# Altium schematic sheet Battery PCB 8x4.SchDoc
size A4
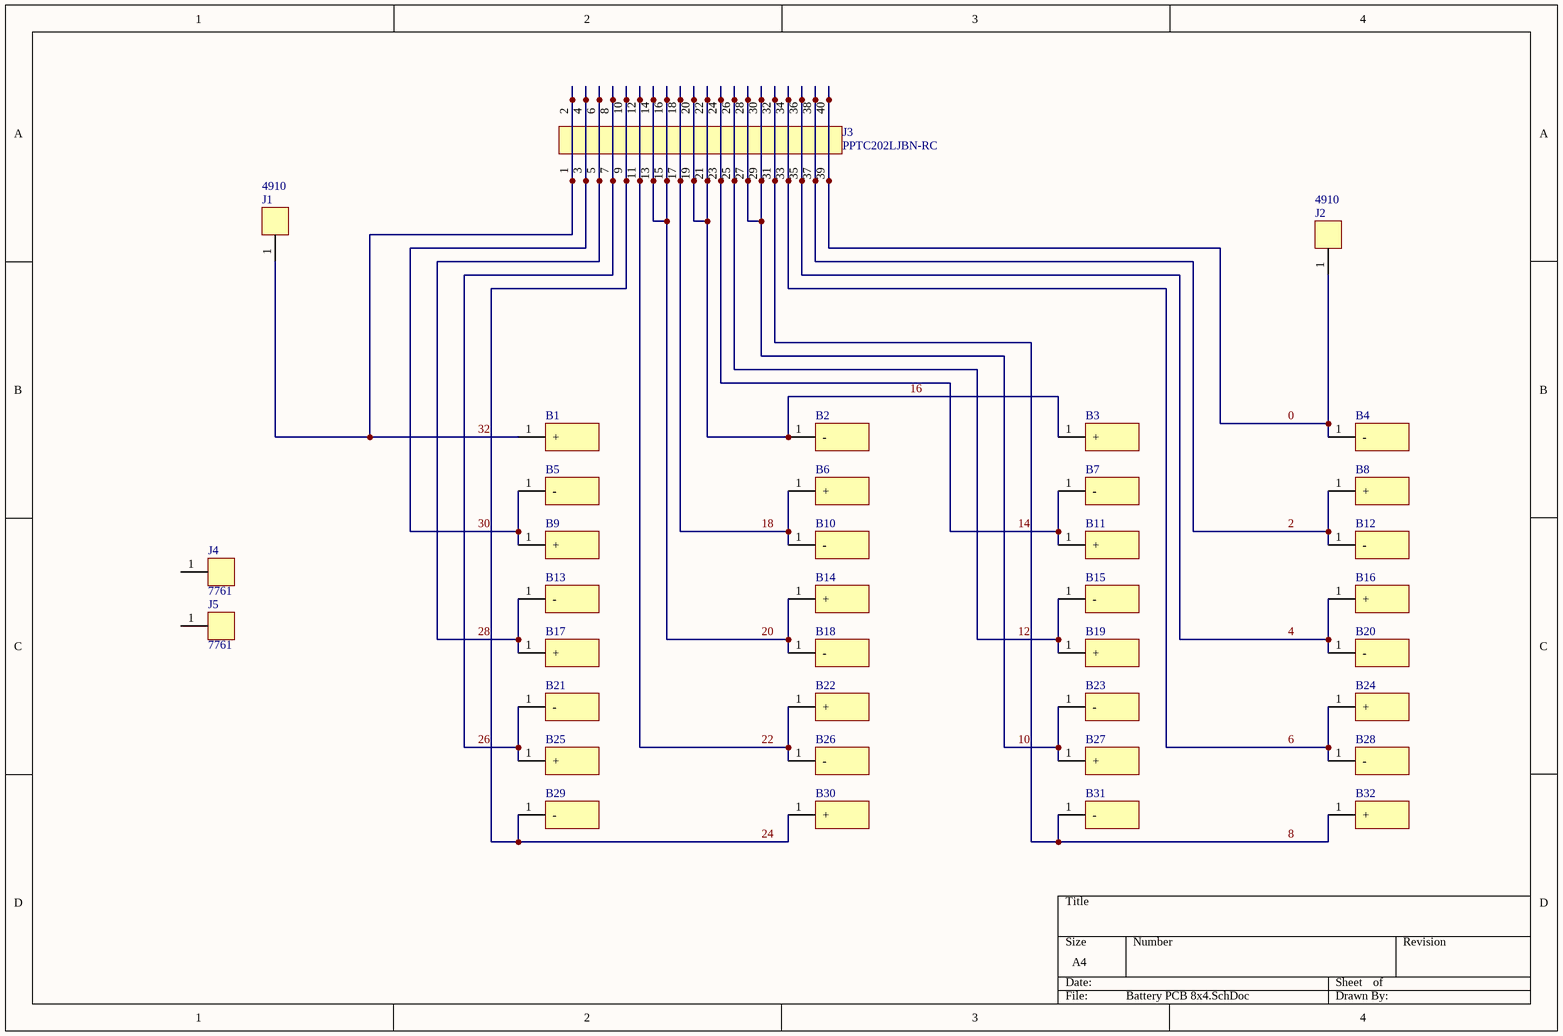
[diagram p0: Battery PCB 8x4.SchDoc]

## Parts
B1  Positive side of battery  [BF_BATT_P]  (value not drawn)  (no BOM)
B2  Negative side of battery  [BF_BATT_N]  (value not drawn)  (no BOM)
B3  Positive side of battery  [BF_BATT_P]  (value not drawn)  (no BOM)
B4  Negative side of battery  [BF_BATT_N]  (value not drawn)  (no BOM)
B5  Negative side of battery  [BF_BATT_N]  (value not drawn)  (no BOM)
B6  Positive side of battery  [BF_BATT_P]  (value not drawn)  (no BOM)
B7  Negative side of battery  [BF_BATT_N]  (value not drawn)  (no BOM)
B8  Positive side of battery  [BF_BATT_P]  (value not drawn)  (no BOM)
B9  Positive side of battery  [BF_BATT_P]  (value not drawn)  (no BOM)
B10  Negative side of battery  [BF_BATT_N]  (value not drawn)  (no BOM)
B11  Positive side of battery  [BF_BATT_P]  (value not drawn)  (no BOM)
B12  Negative side of battery  [BF_BATT_N]  (value not drawn)  (no BOM)
B13  Negative side of battery  [BF_BATT_N]  (value not drawn)  (no BOM)
B14  Positive side of battery  [BF_BATT_P]  (value not drawn)  (no BOM)
B15  Negative side of battery  [BF_BATT_N]  (value not drawn)  (no BOM)
B16  Positive side of battery  [BF_BATT_P]  (value not drawn)  (no BOM)
B17  Positive side of battery  [BF_BATT_P]  (value not drawn)  (no BOM)
B18  Negative side of battery  [BF_BATT_N]  (value not drawn)  (no BOM)
B19  Positive side of battery  [BF_BATT_P]  (value not drawn)  (no BOM)
B20  Negative side of battery  [BF_BATT_N]  (value not drawn)  (no BOM)
B21  Negative side of battery  [BF_BATT_N]  (value not drawn)  (no BOM)
B22  Positive side of battery  [BF_BATT_P]  (value not drawn)  (no BOM)
B23  Negative side of battery  [BF_BATT_N]  (value not drawn)  (no BOM)
B24  Positive side of battery  [BF_BATT_P]  (value not drawn)  (no BOM)
B25  Positive side of battery  [BF_BATT_P]  (value not drawn)  (no BOM)
B26  Negative side of battery  [BF_BATT_N]  (value not drawn)  (no BOM)
B27  Positive side of battery  [BF_BATT_P]  (value not drawn)  (no BOM)
B28  Negative side of battery  [BF_BATT_N]  (value not drawn)  (no BOM)
B29  Negative side of battery  [BF_BATT_N]  (value not drawn)  (no BOM)
B30  Positive side of battery  [BF_BATT_P]  (value not drawn)  (no BOM)
B31  Negative side of battery  [BF_BATT_N]  (value not drawn)  (no BOM)
B32  Positive side of battery  [BF_BATT_P]  (value not drawn)  (no BOM)
J1  value 4910  [4910]  (hidden comment: Conn QC TAB 0.250 RA TH)
J2  value 4910  [4910]  (hidden comment: Conn QC TAB 0.250 RA TH)
J3  value PPTC202LJBN-RC  [PPTC202LJBN-RC]  (hidden comment: Conn Recept 40Pos 0.1" dual row TH RA)
J4  value 7761  [7761]  (hidden comment: Conn Screw M3 RA TH)
J5  value 7761  [7761]  (hidden comment: Conn Screw M3 RA TH)

## Nets
0: B4.1(-) J2.1 J3.39 J3.40
2: B8.1(+) B12.1(-) J3.37 J3.38
4: B16.1(+) B20.1(-) J3.35 J3.36
6: B24.1(+) B28.1(-) J3.33 J3.34
8: B31.1(-) B32.1(+) J3.31 J3.32
10: B23.1(-) B27.1(+) J3.27 J3.28 J3.29 J3.30
12: B15.1(-) B19.1(+) J3.25 J3.26
14: B7.1(-) B11.1(+) J3.23 J3.24
16: B2.1(-) B3.1(+) J3.19 J3.20 J3.21 J3.22
18: B6.1(+) B10.1(-) J3.17 J3.18
20: B14.1(+) B18.1(-) J3.13 J3.14 J3.15 J3.16
22: B22.1(+) B26.1(-) J3.11 J3.12
24: B29.1(-) B30.1(+) J3.9 J3.10
26: B21.1(-) B25.1(+) J3.7 J3.8
28: B13.1(-) B17.1(+) J3.5 J3.6
30: B5.1(-) B9.1(+) J3.3 J3.4
32: B1.1(+) J1.1 J3.1 J3.2

Not connected (* = marked no-connect by the designer): J4 1; J5 1

## Library data of the parts
B1 B3 B6 B8 B9 B11 B14 B16 B17 B19 B22 B24 B25 B27 B30 B32 = BF_BATT_P: Dist: Digi-Key
B2 B4 B5 B7 B10 B12 B13 B15 B18 B20 B21 B23 B26 B28 B29 B31 = BF_BATT_N: Dist: Digi-Key
J1 J2 = 4910: Dist: Digi-Key; Dist P/N: 36-4910-ND; Mfg: Keystone Electronics; Mfgr P/N: 4910; Price: 2.75; HelpURL: https://www.keyelco.com/userAssets/file/M65p59.pdf
J3 = PPTC202LJBN-RC: Dist: Digi-Key; Dist P/N: S5534-ND; Mfg: Sullins Connector Solutions; Mfgr P/N: PPTC202LJBN-RC; Price: 2.75; HelpURL: https://drawings-pdf.s3.amazonaws.com/10494.pdf
J4 J5 = 7761: Dist: Digi-Key; Dist P/N: 36-7761-ND; Mfg: Keystone Electronics; Mfgr P/N: 7761; Price: 0.77; HelpURL: https://www.keyelco.com/userAssets/file/M65p69.pdf